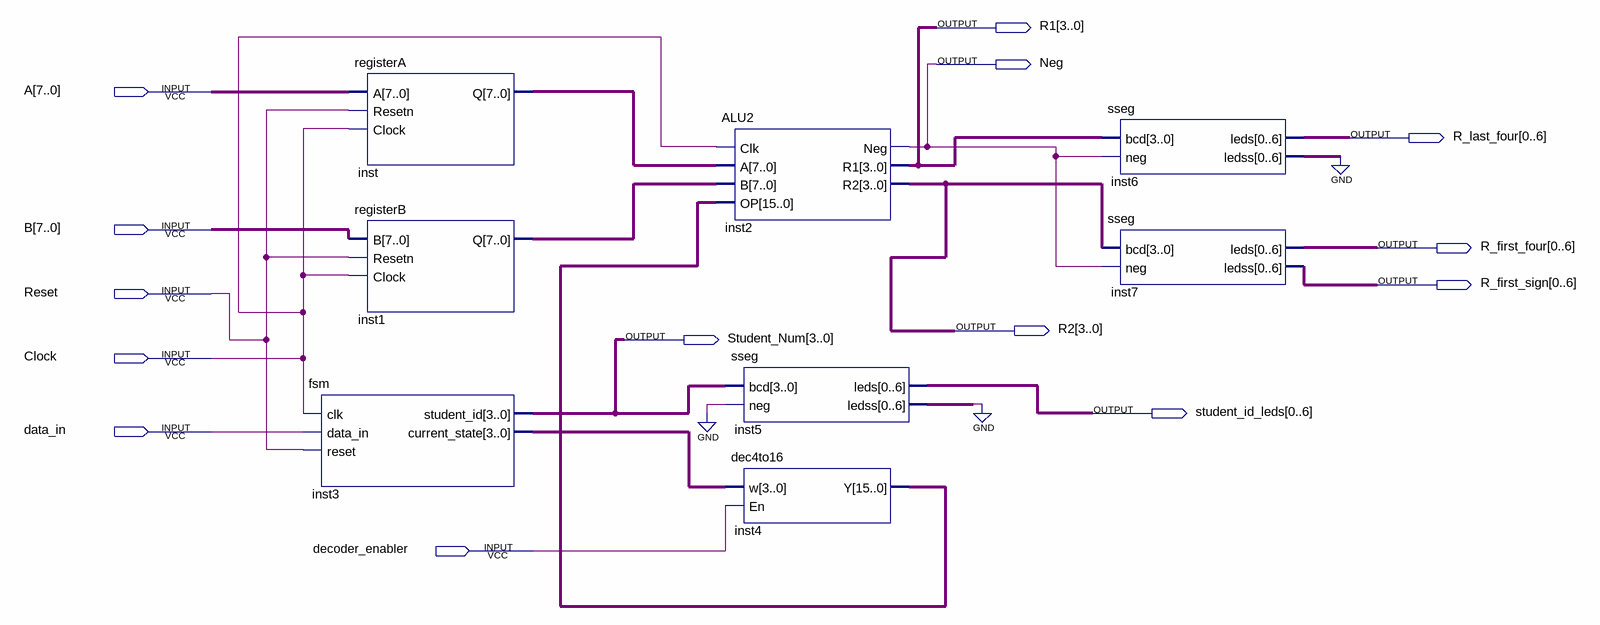
[diagram p0: schematic sheet]
// Quartus schematic Part2.bdf as structural Verilog: 8 symbols, 14 pins
module Part2 (
  input  [7:0] A,
  input  [7:0] B,
  input  Reset,
  input  Clock,
  input  data_in,
  input  decoder_enabler,
  output [3:0] R1,
  output Neg,
  output [0:6] R_last_four,
  output [0:6] R_first_four,
  output [0:6] R_first_sign,
  output [3:0] R2,
  output [3:0] Student_Num,
  output [0:6] student_id_leds
);

  wire [3:0] inst3_current_state;
  wire [6:0] inst5_ledss, inst6_ledss;
  wire [7:0] inst1_q, inst_q;
  wire [15:0] inst4_y;

  fsm inst3 (
    .clk(Clock), .data_in(data_in), .reset(Reset), .student_id(Student_Num),
    .current_state(inst3_current_state));
  registerA inst (.A(A), .Resetn(Reset), .Clock(Clock), .Q(inst_q));
  registerB inst1 (.B(B), .Resetn(Reset), .Clock(Clock), .Q(inst1_q));
  ALU2 inst2 (.Clk(Clock), .A(inst_q), .B(inst1_q), .OP(inst4_y), .Neg(Neg), .R1(R1), .R2(R2));
  sseg inst5 (.bcd(Student_Num), .neg(1'b0), .leds(student_id_leds), .ledss(inst5_ledss));
  dec4to16 inst4 (.w(inst3_current_state), .En(decoder_enabler), .Y(inst4_y));
  sseg inst6 (.bcd(R1), .neg(Neg), .leds(R_last_four), .ledss(inst6_ledss));
  sseg inst7 (.bcd(R2), .neg(Neg), .leds(R_first_four), .ledss(R_first_sign));
  // also tied to GND on the sheet: {inst6_ledss[0], inst6_ledss[1], inst6_ledss[2], inst6_ledss[3], inst6_ledss[4], inst6_ledss[5], inst6_ledss[6]}
endmodule
